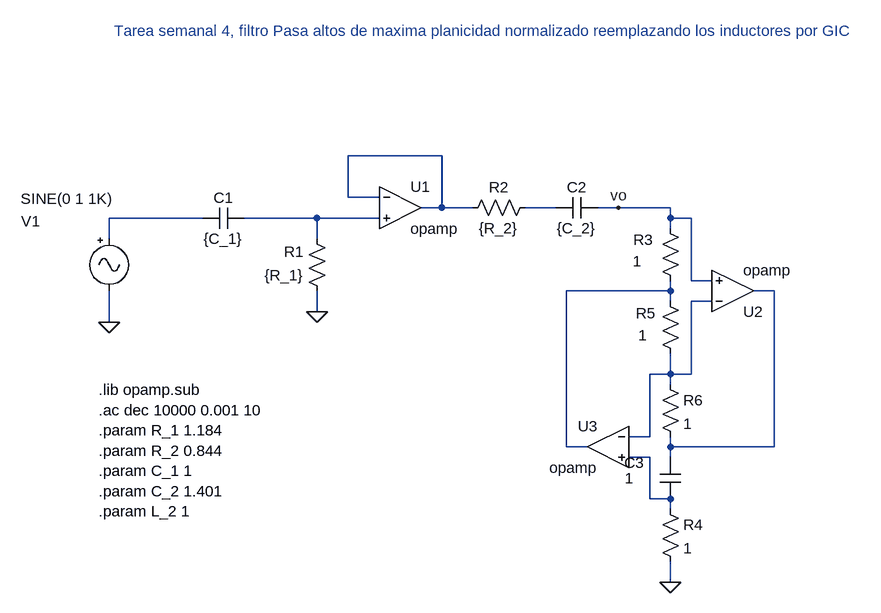
[diagram p0: schematic ts4_gic.asc]
ts4_gic.asc, the LTspice schematic file:
Version 4
SHEET 1 1160 864
WIRE 544 192 400 192
WIRE 400 256 400 192
WIRE 448 256 400 256
WIRE 544 272 544 192
WIRE 544 272 512 272
WIRE 592 272 544 272
WIRE 720 272 672 272
WIRE 816 272 784 272
WIRE 896 272 816 272
WIRE 176 288 32 288
WIRE 352 288 240 288
WIRE 448 288 352 288
WIRE 896 288 896 272
WIRE 928 288 896 288
WIRE 896 304 896 288
WIRE 32 320 32 288
WIRE 352 320 352 288
WIRE 928 384 928 288
WIRE 960 384 928 384
WIRE 896 400 896 384
WIRE 896 400 736 400
WIRE 1056 400 1024 400
WIRE 896 416 896 400
WIRE 960 416 928 416
WIRE 352 432 352 400
WIRE 32 448 32 400
WIRE 896 528 896 496
WIRE 896 528 864 528
WIRE 928 528 928 416
WIRE 928 528 896 528
WIRE 896 544 896 528
WIRE 864 624 864 528
WIRE 864 624 832 624
WIRE 736 640 736 400
WIRE 768 640 736 640
WIRE 896 640 896 624
WIRE 1056 640 1056 400
WIRE 1056 640 896 640
WIRE 864 656 832 656
WIRE 896 656 896 640
WIRE 864 720 864 656
WIRE 896 720 864 720
WIRE 896 736 896 720
WIRE 896 848 896 816
FLAG 352 432 0
FLAG 32 448 0
FLAG 816 272 vo
FLAG 896 848 0
SYMBOL Opamps/opamp 480 208 R0
SYMATTR InstName U1
SYMBOL res 368 416 R180
WINDOW 0 36 76 Left 2
WINDOW 3 36 40 Left 2
SYMATTR InstName R1
SYMATTR Value {R_1}
SYMBOL res 688 256 R90
WINDOW 0 0 56 VBottom 2
WINDOW 3 32 56 VTop 2
SYMATTR InstName R2
SYMATTR Value {R_2}
SYMBOL cap 784 288 M270
WINDOW 0 32 32 VTop 2
WINDOW 3 0 32 VBottom 2
SYMATTR InstName C2
SYMATTR Value {C_2}
SYMBOL cap 176 304 R270
WINDOW 0 32 32 VTop 2
WINDOW 3 0 32 VBottom 2
SYMATTR InstName C1
SYMATTR Value {C_1}
SYMBOL Misc/signal 32 304 R0
WINDOW 0 -135 -11 Left 2
WINDOW 3 -136 -46 Left 2
SYMATTR InstName V1
SYMATTR Value2 AC 1
SYMBOL res 880 288 R0
WINDOW 0 -41 33 Left 2
WINDOW 3 -42 66 Left 2
SYMATTR InstName R3
SYMATTR Value 1
SYMBOL res 880 720 R0
SYMATTR InstName R4
SYMATTR Value 1
SYMBOL cap 880 656 R0
WINDOW 0 -55 8 Left 2
WINDOW 3 -54 32 Left 2
SYMATTR InstName C3
SYMATTR Value 1
SYMBOL res 880 400 R0
WINDOW 0 -37 34 Left 2
WINDOW 3 -33 68 Left 2
SYMATTR InstName R5
SYMATTR Value 1
SYMBOL res 880 528 R0
SYMATTR InstName R6
SYMATTR Value 1
SYMBOL Opamps/opamp 992 464 M180
SYMATTR InstName U2
SYMBOL Opamps/opamp 800 576 M0
SYMATTR InstName U3
TEXT 16 552 Left 2 !.lib opamp.sub\n.ac dec 10000 0.001 10\n.param R_1 1.184\n.param R_2 0.844\n.param C_1 1\n.param C_2 1.401\n.param L_2 1
TEXT 40 0 Left 2 ;Tarea semanal 4, filtro Pasa altos de maxima planicidad normalizado reemplazando los inductores por GIC

The netlist it stands for:
* ts4_gic.asc
XU1 N001 N004 N001 opamp Aol=100K GBW=10Meg  ; pins invin noninvin out
R1 0 N004 {R_1}
R2 N002 N001 {R_2}
C2 vo N002 {C_2}
C1 N003 N004 {C_1}
V1 N003 0 SINE(0 1 1K) AC 1
R3 vo N005 1
R4 N008 0 1
C3 N006 N008 1
R5 N005 N007 1
R6 N007 N006 1
XU2 N007 vo N006 opamp Aol=100K GBW=10Meg  ; pins invin noninvin out
XU3 N007 N008 N005 opamp Aol=100K GBW=10Meg  ; pins invin noninvin out
.lib opamp.sub
.ac dec 10000 0.001 10
.param R_1 1.184
.param R_2 0.844
.param C_1 1
.param C_2 1.401
.param L_2 1
* Tarea semanal 4, filtro Pasa altos de maxima planicidad normalizado reemplazando los inductores por GIC
.backanno
.end